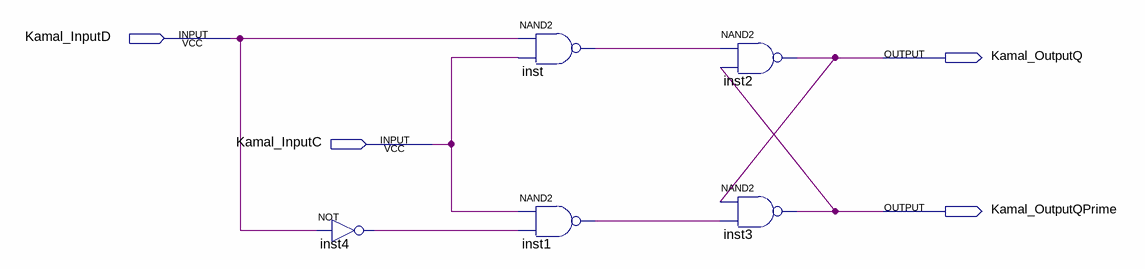
[diagram p0: schematic sheet]
// Quartus schematic Kamal_Faheem_DLatch.bdf as structural Verilog: 5 symbols, 4 pins
module Kamal_Faheem_DLatch (
  input  Kamal_InputD,
  input  Kamal_InputC,
  output Kamal_OutputQ,
  output Kamal_OutputQPrime
);

  wire inst1_out, inst4_out, inst_out;

  not inst4 (inst4_out, Kamal_InputD);
  nand inst (inst_out, Kamal_InputD, Kamal_InputC);
  nand inst1 (inst1_out, Kamal_InputC, inst4_out);
  nand inst2 (Kamal_OutputQ, inst_out, Kamal_OutputQPrime);
  nand inst3 (Kamal_OutputQPrime, Kamal_OutputQ, inst1_out);
endmodule
